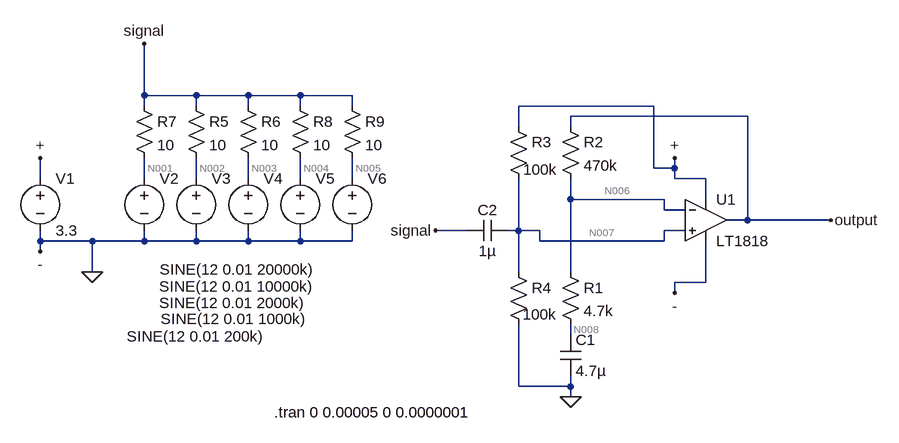
[diagram p0: schematic ac1.asc]
ac1.asc, the LTspice schematic file:
Version 4
SHEET 1 1212 680
WIRE 64 -96 64 -176
WIRE 144 -96 64 -96
WIRE 224 -96 144 -96
WIRE 304 -96 224 -96
WIRE 384 -96 304 -96
WIRE 64 -80 64 -96
WIRE 144 -80 144 -96
WIRE 224 -80 224 -96
WIRE 304 -80 304 -96
WIRE 384 -80 384 -96
WIRE 848 -80 640 -80
WIRE 992 -64 720 -64
WIRE 640 -48 640 -80
WIRE 720 -48 720 -64
WIRE 848 16 848 -80
WIRE 880 16 880 0
WIRE 880 16 848 16
WIRE -96 32 -96 0
WIRE 64 32 64 0
WIRE 144 32 144 0
WIRE 224 32 224 0
WIRE 304 32 304 0
WIRE 384 32 384 0
WIRE 880 32 880 16
WIRE 928 32 880 32
WIRE 720 64 720 32
WIRE 864 64 720 64
WIRE 928 64 928 32
WIRE 864 80 864 64
WIRE 896 80 864 80
WIRE 992 96 992 -64
WIRE 992 96 960 96
WIRE 1120 96 992 96
WIRE 560 112 512 112
WIRE 640 112 640 32
WIRE 640 112 624 112
WIRE 672 112 640 112
WIRE 896 112 864 112
WIRE -96 128 -96 112
WIRE -16 128 -96 128
WIRE 64 128 64 112
WIRE 64 128 -16 128
WIRE 144 128 144 112
WIRE 144 128 64 128
WIRE 224 128 224 112
WIRE 224 128 144 128
WIRE 304 128 304 112
WIRE 304 128 224 128
WIRE 384 128 384 112
WIRE 384 128 304 128
WIRE 672 128 672 112
WIRE 864 128 864 112
WIRE 864 128 672 128
WIRE -96 144 -96 128
WIRE -16 176 -16 128
WIRE 640 176 640 112
WIRE 720 176 720 64
WIRE 928 192 928 128
WIRE 928 192 880 192
WIRE 880 208 880 192
WIRE 720 272 720 256
WIRE 640 352 640 256
WIRE 720 352 720 336
WIRE 720 352 640 352
WIRE 720 368 720 352
FLAG -96 0 +
FLAG -96 144 -
FLAG -16 176 0
FLAG 64 -176 signal
FLAG 880 0 +
FLAG 880 208 -
FLAG 1120 96 output
FLAG 512 112 signal
FLAG 720 368 0
SYMBOL voltage -96 16 R0
WINDOW 123 0 0 Left 2
WINDOW 39 0 0 Left 2
SYMATTR InstName V1
SYMATTR Value 3.3
SYMBOL voltage 64 16 R0
WINDOW 3 24 156 Left 2
WINDOW 123 0 0 Left 2
WINDOW 39 0 0 Left 2
SYMATTR Value SINE(12 0.01 20000k)
SYMATTR InstName V2
SYMBOL res 704 160 R0
SYMATTR InstName R1
SYMATTR Value 4.7k
SYMBOL res 704 -64 R0
SYMATTR InstName R2
SYMATTR Value 470k
SYMBOL res 624 -64 R0
WINDOW 3 23 82 Left 2
SYMATTR Value 100k
SYMATTR InstName R3
SYMBOL res 624 160 R0
WINDOW 3 22 81 Left 2
SYMATTR Value 100k
SYMATTR InstName R4
SYMBOL cap 624 96 R90
WINDOW 0 0 32 VBottom 2
WINDOW 3 32 32 VTop 2
SYMATTR InstName C2
SYMATTR Value 1µ
SYMBOL voltage 144 16 R0
WINDOW 3 -57 182 Left 2
WINDOW 123 0 0 Left 2
WINDOW 39 0 0 Left 2
SYMATTR Value SINE(12 0.01 10000k)
SYMATTR InstName V3
SYMBOL voltage 224 16 R0
WINDOW 3 -137 207 Left 2
WINDOW 123 0 0 Left 2
WINDOW 39 0 0 Left 2
SYMATTR Value SINE(12 0.01 2000k)
SYMATTR InstName V4
SYMBOL res 128 -96 R0
SYMATTR InstName R5
SYMATTR Value 10
SYMBOL res 208 -96 R0
SYMATTR InstName R6
SYMATTR Value 10
SYMBOL res 48 -96 R0
SYMATTR InstName R7
SYMATTR Value 10
SYMBOL voltage 304 16 R0
WINDOW 3 -215 232 Left 2
WINDOW 123 0 0 Left 2
WINDOW 39 0 0 Left 2
SYMATTR Value SINE(12 0.01 1000k)
SYMATTR InstName V5
SYMBOL voltage 384 16 R0
WINDOW 3 -347 259 Left 2
WINDOW 123 0 0 Left 2
WINDOW 39 0 0 Left 2
SYMATTR Value SINE(12 0.01 200k)
SYMATTR InstName V6
SYMBOL res 288 -96 R0
SYMATTR InstName R8
SYMATTR Value 10
SYMBOL res 368 -96 R0
SYMATTR InstName R9
SYMATTR Value 10
SYMBOL Opamps\\LT1818 928 96 R0
SYMATTR InstName U1
SYMBOL cap 704 272 R0
SYMATTR InstName C1
SYMATTR Value 4.7µ
TEXT 264 392 Left 2 !.tran 0 0.00005 0 0.0000001

The netlist it stands for:
* ac1.asc
V1 + 0 3.3
V2 N001 0 SINE(12 0.01 20000k)
R1 N006 N008 4.7k
R2 output N006 470k
R3 + N007 100k
R4 N007 0 100k
C2 N007 signal 1µ
V3 N002 0 SINE(12 0.01 10000k)
V4 N003 0 SINE(12 0.01 2000k)
R5 signal N002 10
R6 signal N003 10
R7 signal N001 10
V5 N004 0 SINE(12 0.01 1000k)
V6 N005 0 SINE(12 0.01 200k)
R8 signal N004 10
R9 signal N005 10
XU1 N007 N006 output + 0 LT1818  ; pins In+ In- OUT V+ V-
C1 N008 0 4.7µ
.tran 0 0.00005 0 0.0000001
.lib LTC2.lib
.backanno
.end

* Results of the author's LTspice run, read from the files saved beside the schematic
* Operating Point, zero values left out:
*   V(+) = 3.3 V
*   V(n001) = 12 V
*   V(n006) = 1.733 V
*   V(n008) = 1.733 V
*   V(output) = 954.8 mV
*   V(n007) = 1.733 V
*   V(signal) = 12 V
*   V(n002) = 12 V
*   V(n003) = 12 V
*   V(n004) = 12 V
*   V(n005) = 12 V
*   I(R4) = 17.33 µA
*   I(R3) = 15.67 µA
*   I(R2) = -1.656 µA
*   I(V1) = -8.335 mA
*   Ix(u1:1) = -1.657 µA
*   Ix(u1:2) = -1.656 µA
*   Ix(u1:3) = 1.656 µA
*   Ix(u1:4) = 8.319 mA
*   Ix(u1:5) = -8.318 mA
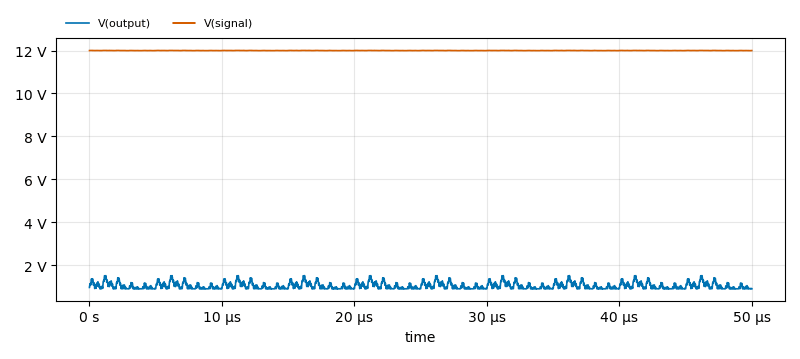
[diagram p1: Transient Analysis of ac1.asc, plotted from the saved traces]
* Transient Analysis, 1 run:
*   V(output): min 894.7 mV, max 1.512 V, average 1.036 V, rms 1.047 V, last 896.1 mV
*   V(signal): min 11.99 V, max 12.01 V, average 12 V, rms 12 V, last 12 V